# EAGLE design ground_station_power_board (EAGLE 9.1.1)
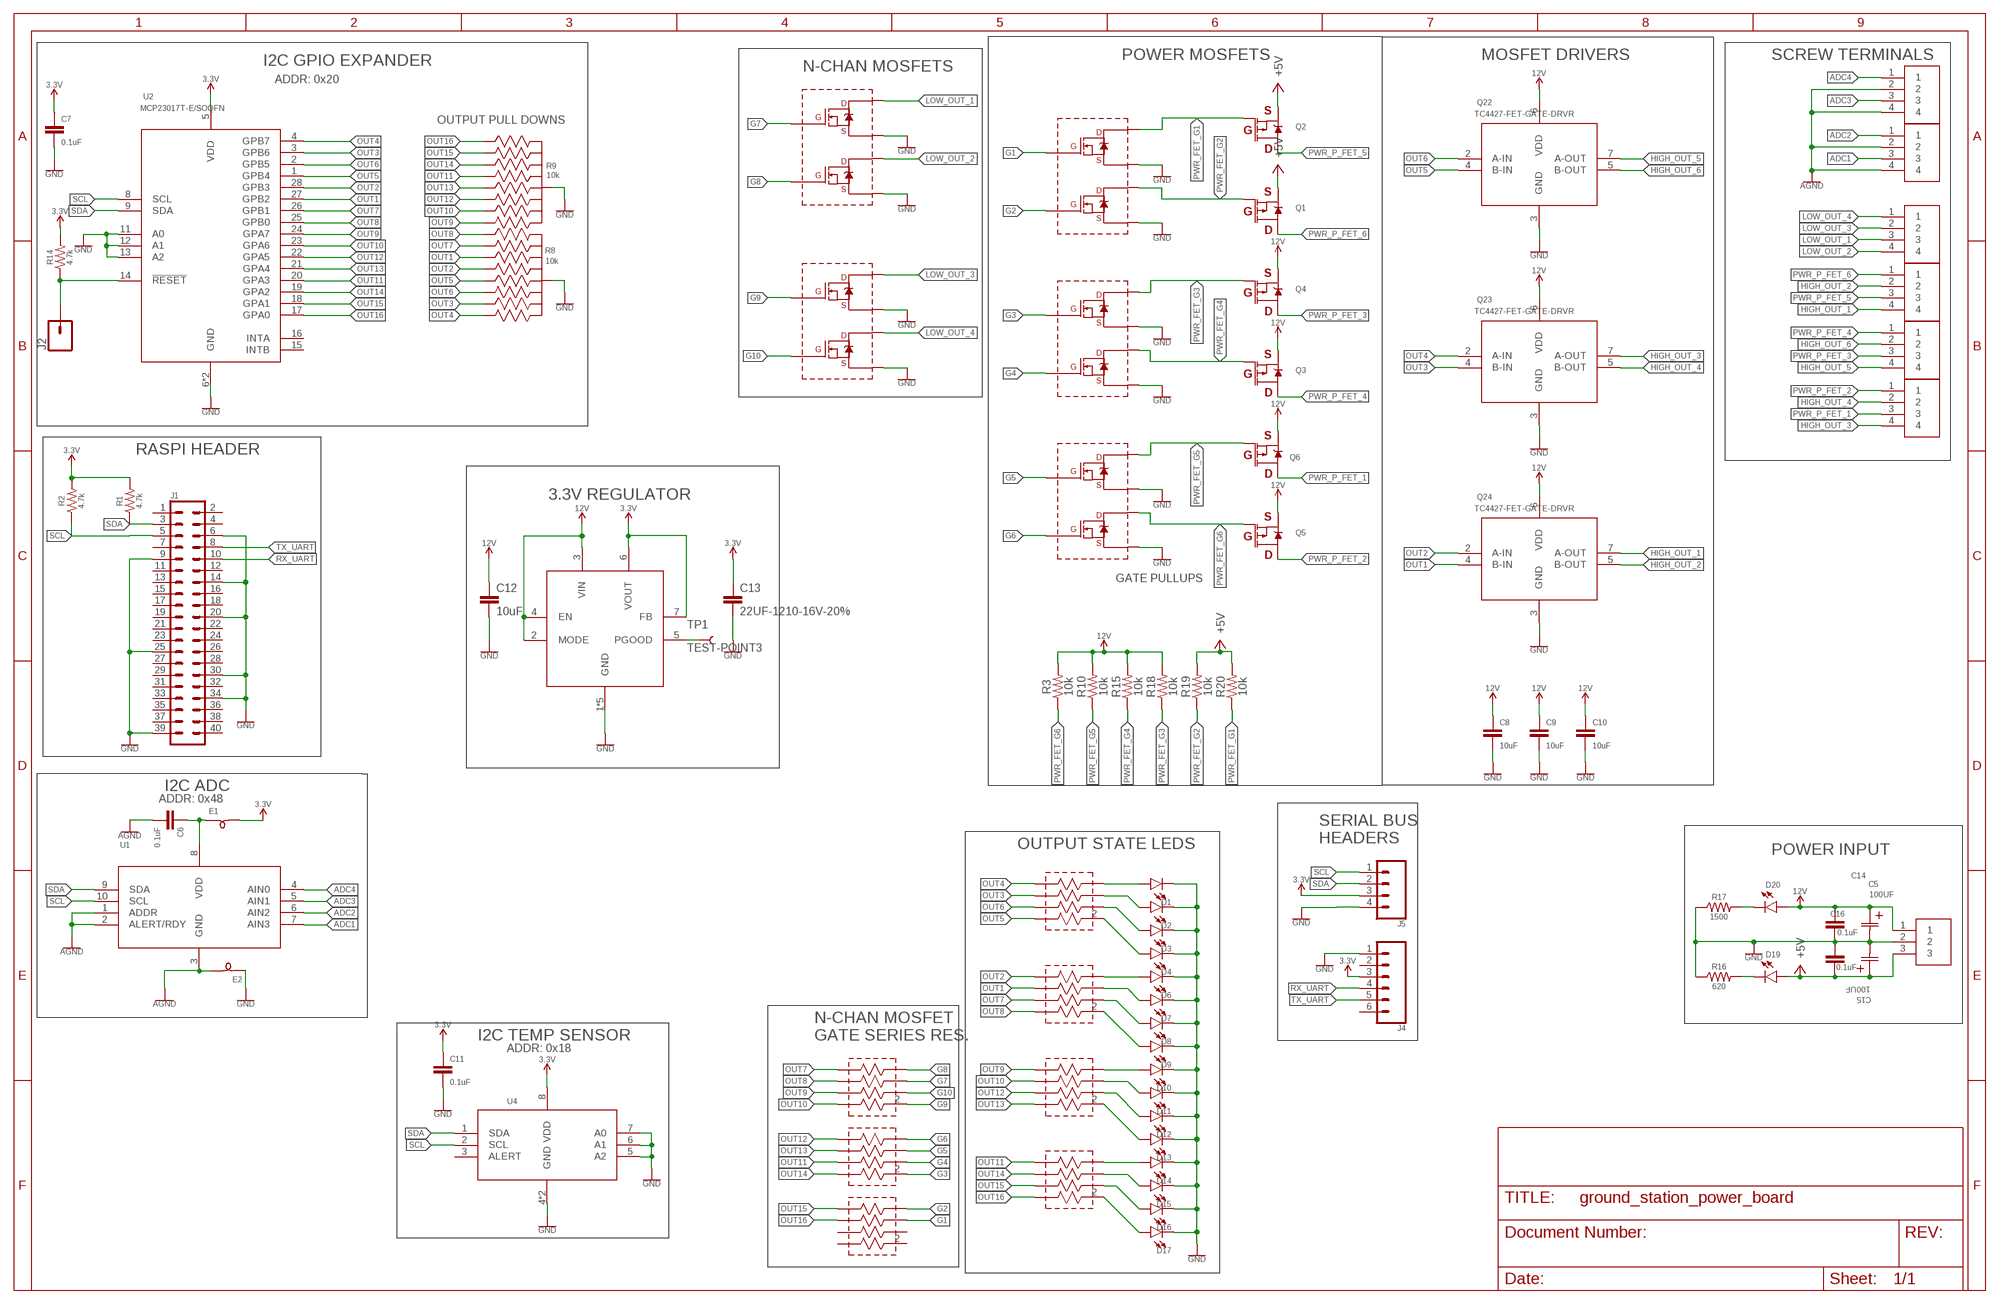
[diagram p0: schematic, sheet 1]

## Parts
C5  100UF  100UF-CAP-EMVH630ARA101MKE0SCHEMI-KE0-M  [CHEMI-KE0-M]
C6  0.1uF  0.1UF-0603-25V-5%  [0603]
C7  0.1uF  0.1UF-0603-25V-5%  [0603]
C8  10uF  10UF-0805-10V-10%  [0805]
C9  10uF  10UF-0805-10V-10%  [0805]
C10  10uF  10UF-0805-10V-10%  [0805]
C11  0.1uF  0.1UF-0603-25V-5%  [0603]
C12  10uF  10UF-1206-6.3V-20%  [1206]
C13  22UF-1210-16V-20%  [1210]
C14  0.1uF  0.1UF-0603-25V-5%  [0603]
C15  100UF  100UF-CAP-EMVH630ARA101MKE0SCHEMI-KE0-M  [CHEMI-KE0-M]
C16  0.1uF  0.1UF-0603-25V-5%  [0603]
D1  LED0603  [LED-0603]
D2  LED0603  [LED-0603]
D3  LED0603  [LED-0603]
D4  LED0603  [LED-0603]
D6  LED0603  [LED-0603]
D7  LED0603  [LED-0603]
D8  LED0603  [LED-0603]
D9  LED0603  [LED-0603]
D10  LED0603  [LED-0603]
D11  LED0603  [LED-0603]
D12  LED0603  [LED-0603]
D13  LED0603  [LED-0603]
D14  LED0603  [LED-0603]
D15  LED0603  [LED-0603]
D16  LED0603  [LED-0603]
D17  LED0603  [LED-0603]
D19  LED0603  [LED-0603]
D20  LED0603  [LED-0603]
E1  L-BEAD-0805-B  [.0805-B]
E2  L-BEAD-0805-B  [.0805-B]
J1  CONN_20X2SHROUDED  [2X20_SHROUDED]
J2  CONN_01PTH_NO_SILK_KIT  [1X01NS_KIT]
J4  CONN_06LONGPADS  [1X06_LONGPADS]
J5  CONN_04LONGPADS  [1X04_LONGPADS]
Q1  SQJ459EP_MOSFET_P_CHAN  [POWERPAK_S0-8L]
Q2  SQJ459EP_MOSFET_P_CHAN  [POWERPAK_S0-8L]
Q3  SQJ459EP_MOSFET_P_CHAN  [POWERPAK_S0-8L]
Q4  SQJ459EP_MOSFET_P_CHAN  [POWERPAK_S0-8L]
Q5  SQJ459EP_MOSFET_P_CHAN  [POWERPAK_S0-8L]
Q6  SQJ459EP_MOSFET_P_CHAN  [POWERPAK_S0-8L]
Q8  DMN61D8LVT-DUAL-N-CHANNEL-MOSFET  [TSOT26]
Q9  DMN61D8LVT-DUAL-N-CHANNEL-MOSFET  [TSOT26]
Q15  DMN61D8LVT-DUAL-N-CHANNEL-MOSFET  [TSOT26]
Q17  DMN61D8LVT-DUAL-N-CHANNEL-MOSFET  [TSOT26]
Q18  DMN61D8LVT-DUAL-N-CHANNEL-MOSFET  [TSOT26]
Q22  TC4427-FET-GATE-DRVR  [TSSOP-8]
Q23  TC4427-FET-GATE-DRVR  [TSSOP-8]
Q24  TC4427-FET-GATE-DRVR  [TSSOP-8]
R1  4.7k  4.7KOHM-0603-1/10W-1%  [0603]
R2  4.7k  4.7KOHM-0603-1/10W-1%  [0603]
R3  10k  10KOHM-0603-1/10W-1%  [0603]
R4  680  RES-ARRAY-742C083  [RES-ARRAY-742C083]
R5  680  RES-ARRAY-742C083  [RES-ARRAY-742C083]
R6  680  RES-ARRAY-742C083  [RES-ARRAY-742C083]
R7  680  RES-ARRAY-742C083  [RES-ARRAY-742C083]
R8  10k  EXB-A10P391JC_ARRAY_EXBA-M  [C_ARRAY_EXBA-M]
R9  10k  EXB-A10P391JC_ARRAY_EXBA-M  [C_ARRAY_EXBA-M]
R10  10k  10KOHM-0603-1/10W-1%  [0603]
R11  220  RES-ARRAY-742C083  [RES-ARRAY-742C083]
R12  220  RES-ARRAY-742C083  [RES-ARRAY-742C083]
R13  220  RES-ARRAY-742C083  [RES-ARRAY-742C083]
R14  4.7k  4.7KOHM-0603-1/10W-1%  [0603]
R15  10k  10KOHM-0603-1/10W-1%  [0603]
R16  620  4.7KOHM-0603-1/10W-1%  [0603]
R17  1500  4.7KOHM-0603-1/10W-1%  [0603]
R18  10k  10KOHM-0603-1/10W-1%  [0603]
R19  10k  10KOHM-0603-1/10W-1%  [0603]
R20  10k  10KOHM-0603-1/10W-1%  [0603]
TP1  TEST-POINT3  [PAD.03X.03]
U1  ADS1115IDGSTDGS10-M  [DGS10-M]
U2  MCP23017T-E/SOQFN  [QFN28_6X6MC-M]
U4  MCP9808T-E/MCDFN8_2X3MC-M  [DFN8_2X3MC-M]
U$1  1719031-PHONEIX-CONTACT-DBL-TERMINAL-BLOCK  [1719031-PHONEIX-CONTACT-DBL-TERMINAL-BLOCK]
U$2  1719031-PHONEIX-CONTACT-DBL-TERMINAL-BLOCK  [1719031-PHONEIX-CONTACT-DBL-TERMINAL-BLOCK]
U$3  1719031-PHONEIX-CONTACT-DBL-TERMINAL-BLOCK  [1719031-PHONEIX-CONTACT-DBL-TERMINAL-BLOCK]
U$4  1719031-PHONEIX-CONTACT-DBL-TERMINAL-BLOCK  [1719031-PHONEIX-CONTACT-DBL-TERMINAL-BLOCK]
U$5  1719031-PHONEIX-CONTACT-DBL-TERMINAL-BLOCK  [1719031-PHONEIX-CONTACT-DBL-TERMINAL-BLOCK]
U$6  1719031-PHONEIX-CONTACT-DBL-TERMINAL-BLOCK  [1719031-PHONEIX-CONTACT-DBL-TERMINAL-BLOCK]
U$9  LMZM23601V3SILT  [MICRO-SIP]
U$11  1714968-PHONEIX-CONTACT-TERMINAL-BLOCK  [1714968-PHONEIX-CONTACT-3-TERMINAL-BLOCK]

## Nets
3.3V: C7.1 C11.1 C13.1 E1.2 J4.3 J5.3 R1.2 R2.2 R14.2 U2.5(VDD) U4.8(VDD) U$9.6(VOUT) U$9.7(FB)
12V: C5.1 C8.1 C9.1 C10.1 C12.1 C14.1 D20.A Q3.S1(S) Q3.S2(S) Q3.S3(S) Q4.S1(S) Q4.S2(S) Q4.S3(S) Q5.S1(S) Q5.S2(S) Q5.S3(S) Q6.S1(S) Q6.S2(S) Q6.S3(S) Q22.6(VDD) Q23.6(VDD) Q24.6(VDD) R3.2 R10.2 R15.2 R18.2 U$9.2(MODE) U$9.3(VIN) U$9.4(EN) U$11.1
+5V: C15.1 C16.2 D19.A Q1.S1(S) Q1.S2(S) Q1.S3(S) Q2.S1(S) Q2.S2(S) Q2.S3(S) R19.2 R20.2 U$11.3
ADC1: U1.7(AIN3) U$5.3
ADC2: U1.6(AIN2) U$5.1
ADC3: U1.5(AIN1) U$6.3
ADC4: U1.4(AIN0) U$6.1
AGND: C6.2 E2.2 U1.1(ADDR) U1.2(ALERT/RDY) U1.3(GND) U$5.2 U$5.4 U$6.2 U$6.4
G1: Q8.5(G2) R11.6(!1OE6)
G2: Q8.2(G1) R11.8(!1OE8)
G3: Q9.5(G2) R12.2(!1OE2)
G4: Q9.2(G1) R12.4(!1OE4)
G5: Q15.5(G2) R12.6(!1OE6)
G6: Q15.2(G1) R12.8(!1OE8)
G7: Q18.5(G2) R13.6(!1OE6)
G8: Q18.2(G1) R13.8(!1OE8)
G9: Q17.5(G2) R13.2(!1OE2)
G10: Q17.2(G1) R13.4(!1OE4)
GND: C5.2 C7.2 C8.2 C9.2 C10.2 C11.2 C12.2 C13.2 C14.2 C15.2 C16.1 D1.C D2.C D3.C D4.C D6.C D7.C D8.C D9.C D10.C D11.C D12.C D13.C D14.C D15.C D16.C D17.C E2.1 J1.6 J1.9 J1.14 J1.20 J1.25 J1.30 J1.34 J1.39 J4.1 J5.4 Q8.1(S1) Q8.4(S2) Q9.1(S1) Q9.4(S2) Q15.1(S1) Q15.4(S2) Q17.1(S1) Q17.4(S2) Q18.1(S1) Q18.4(S2) Q22.3(GND) Q23.3(GND) Q24.3(GND) R8.5 R8.10 R9.5 R9.10 R16.1 R17.1 U2.6(GND) U2.11(A0) U2.12(A1) U2.13(A2) U2.29(GND) U4.4(GND) U4.5(A2) U4.6(A1) U4.7(A0) U4.9(GND) U$9.1(GND) U$9.TP(GND) U$9.V1(GND) U$9.V2(GND) U$9.V3(GND) U$11.2
HIGH_OUT_1: Q24.7(A-OUT) U$3.4
HIGH_OUT_2: Q24.5(B-OUT) U$3.2
HIGH_OUT_3: Q23.7(A-OUT) U$1.4
HIGH_OUT_4: Q23.5(B-OUT) U$1.2
HIGH_OUT_5: Q22.7(A-OUT) U$2.4
HIGH_OUT_6: Q22.5(B-OUT) U$2.2
LOW_OUT_1: Q18.3(D2) U$4.3
LOW_OUT_2: Q18.6(D1) U$4.4
LOW_OUT_3: Q17.3(D2) U$4.2
LOW_OUT_4: Q17.6(D1) U$4.1
N$1: D1.A R4.8(!1OE8)
N$2: D2.A R4.6(!1OE6)
N$3: D3.A R4.4(!1OE4)
N$4: D4.A R4.2(!1OE2)
N$5: C6.1 E1.1 U1.8(VDD)
N$6: J2.1 R14.1 U2.14(!RESET)
N$7: TP1.P$1 U$9.5(PGOOD)
N$12: D19.C R16.2
N$14: D6.A R5.8(!1OE8)
N$15: D7.A R5.6(!1OE6)
N$16: D8.A R5.4(!1OE4)
N$17: D9.A R5.2(!1OE2)
N$18: D20.C R17.2
N$26: D10.A R6.8(!1OE8)
N$27: D11.A R6.6(!1OE6)
N$28: D12.A R6.4(!1OE4)
N$29: D13.A R6.2(!1OE2)
N$38: D14.A R7.8(!1OE8)
N$39: D15.A R7.6(!1OE6)
N$40: D16.A R7.4(!1OE4)
N$41: D17.A R7.2(!1OE2)
OUT1: Q24.4(B-IN) R5.5(!1OE5) R8.2 U2.27(GPB2)
OUT2: Q24.2(A-IN) R5.7(!1OE7) R8.8 U2.28(GPB3)
OUT3: Q23.4(B-IN) R4.5(!1OE5) R8.4 U2.3(GPB6)
OUT4: Q23.2(A-IN) R4.7(!1OE7) R8.6 U2.4(GPB7)
OUT5: Q22.4(B-IN) R4.1(!1OE1) R8.3 U2.1(GPB4)
OUT6: Q22.2(A-IN) R4.3(!1OE3) R8.7 U2.2(GPB5)
OUT7: R5.3(!1OE3) R8.9 R13.7(!1OE7) U2.26(GPB1)
OUT8: R5.1(!1OE1) R8.1 R13.5(!1OE5) U2.25(GPB0)
OUT9: R6.7(!1OE7) R9.6 R13.3(!1OE3) U2.24(GPA7)
OUT10: R6.5(!1OE5) R9.4 R13.1(!1OE1) U2.23(GPA6)
OUT11: R7.7(!1OE7) R9.8 R12.3(!1OE3) U2.20(GPA3)
OUT12: R6.3(!1OE3) R9.7 R12.7(!1OE7) U2.22(GPA5)
OUT13: R6.1(!1OE1) R9.3 R12.5(!1OE5) U2.21(GPA4)
OUT14: R7.5(!1OE5) R9.2 R12.1(!1OE1) U2.19(GPA2)
OUT15: R7.3(!1OE3) R9.9 R11.7(!1OE7) U2.18(GPA1)
OUT16: R7.1(!1OE1) R9.1 R11.5(!1OE5) U2.17(GPA0)
PWR_FET_G1: Q2.G Q8.3(D2) R20.1
PWR_FET_G2: Q1.G Q8.6(D1) R19.1
PWR_FET_G3: Q4.G Q9.3(D2) R18.1
PWR_FET_G4: Q3.G Q9.6(D1) R15.1
PWR_FET_G5: Q6.G Q15.3(D2) R10.1
PWR_FET_G6: Q5.G Q15.6(D1) R3.1
PWR_P_FET_1: Q6.D1(D) U$1.3
PWR_P_FET_2: Q5.D1(D) U$1.1
PWR_P_FET_3: Q4.D1(D) U$2.3
PWR_P_FET_4: Q3.D1(D) U$2.1
PWR_P_FET_5: Q2.D1(D) U$3.3
PWR_P_FET_6: Q1.D1(D) U$3.1
RX_UART: J1.10 J4.4
SCL: J1.5 J5.1 R2.1 U1.10(SCL) U2.8(SCL) U4.2(SCL)
SDA: J1.3 J5.2 R1.1 U1.9(SDA) U2.9(SDA) U4.1(SDA)
TX_UART: J1.8 J4.5
Unconnected: J1.1 J1.2 J1.4 J1.7 J1.11 J1.12 J1.13 J1.15 J1.16 J1.17 J1.18 J1.19 J1.21 J1.22 J1.23 J1.24 J1.26 J1.27 J1.28 J1.29 J1.31 J1.32 J1.33 J1.35 J1.36 J1.37 J1.38 J1.40 J4.2 J4.6 R11.1(!1OE1) R11.2(!1OE2) R11.3(!1OE3) R11.4(!1OE4) U2.15(INTB) U2.16(INTA) U4.3(ALERT)

## Notes on the sheet
- POWER MOSFETS | MOSFET DRIVERS | SCREW TERMINALS
- I2C GPIO EXPANDER
- N-CHAN MOSFETS
- ADDR: 0x20
- OUTPUT PULL DOWNS
- RASPI HEADER
- 3.3V REGULATOR
- GATE PULLUPS
- I2C ADC
- ADDR: 0x48
- SERIAL BUS
  HEADERS
- OUTPUT STATE LEDS
- POWER INPUT
- I2C TEMP SENSOR
- N-CHAN MOSFET
  GATE SERIES RES.
- ADDR: 0x18

## Library data of the parts
C5 C15 = GROUND-STATION-POWER-BOARD:100UF-CAP-EMVH630ARA101MKE0S; MANUFACTURER_PART_NUMBER: EMVH630ARA101MKE0S; VENDOR: Nippon ChemiCon
C6 C7 C11 C14 C16 = SparkFun-Capacitors:0.1UF: 0.1µF ceramic capacitors A capacitor is a passive two-terminal electrical component used to store electrical energy temporarily in an electric field.; PROD_ID: CAP-08604
C8-C10 = SparkFun-Capacitors:10UF: 10.0µF ceramic capacitors A capacitor is a passive two-terminal electrical component used to store electrical energy temporarily in an electric field.; PROD_ID: CAP-11330
C12 = SparkFun-Capacitors:10UF: 10.0µF ceramic capacitors A capacitor is a passive two-terminal electrical component used to store electrical energy temporarily in an electric field.; PROD_ID: CAP-10057
C13 = SparkFun-Capacitors:22UF: 22µF ceramic capacitors A capacitor is a passive two-terminal electrical component used to store electrical energy temporarily in an electric field.
D1-D4 D6-D17 D19 D20 = SparkFun-LED:LED: LED (Generic) Standard schematic elements and footprints for 5mm, 3mm, 1206, and 0603 sized LEDs. Generic LEDs with no color specified.
E1 E2 = oresat-rcl:L-BEAD-*: Bead or Chip inductor ("ferrite bead") for EMI suppression
J1 = SparkFun-Connectors:CONN_20X2: Multi connection point. Often used as Generic Header-pin footprint for 0.1 inch spaced/style header connections On any of the 0.1 inch spaced packages, you can populate with these: Break Away Headers - Straight <https://www.sparkfun.com/products/116> (PRT-00116) Break Away Male Headers - Right Angle <https://www.sparkfun.com/products/553> (PRT-00553) Female Headers <https://www.sparkfun.com/products/115> (PRT-00115) Break Away Headers - Machine Pin <https://www.sparkfun.com/products/117> (PRT-00117) Break Away Female Headers - Swiss Machine Pin <https://www.sparkfun.com/products/743> (PRT-00743); PROD_ID: CONN-12263; SF_ID: CONN-12263
J2 = SparkFun-Connectors:CONN_01: Single connection point. Often used as Generic Header-pin footprint for 0.1 inch spaced/style header connections On any of the 0.1 inch spaced packages, you can populate with these: Break Away Headers - Straight <https://www.sparkfun.com/products/116> (PRT-00116) Break Away Male Headers - Right Angle <https://www.sparkfun.com/products/553> (PRT-00553) Female Headers <https://www.sparkfun.com/products/115> (PRT-00115) Break Away Headers - Machine Pin <https://www.sparkfun.com/products/117> (PRT-00117) Break Away Female Headers - Swiss Machine Pin <https://www.sparkfun.com/products/743> (PRT-00743) This device is also useful as a general connection point to wire up your design to another part of your project. Our various solder wires solder well into these plated through hole pads. Hook-Up Wire - Assortment (Stranded, 22 AWG) <https://www.sparkfun.com/products/11375> (PRT-11375) Hook-Up Wire - Assortment (Solid Core, 22 AWG) <https://www.sparkfun.com/products/11367> (PRT-11367) View the entire wire category on our website here <https://www.sparkfun.com/categories/141> Special notes: SMTSO-256-ET is a "flush mount" nut for a 4-40 screw. We mostly use this on specialty testbeds; it is a nice way to connect hardware to your PCB at an adjustable hieght. Also note, the SNAP packages are for using a snappable style connector. We sell a baggie of snaps and they are also used on two LilyPad designs: Snap Assortment - 30 pack (male and female) <https://www.sparkfun.com/products/11347> (DEV-11347) LilyPad Arduino SimpleSnap <https://www.sparkfun.com/products/10941> (DEV-10941) LilyPad SimpleSnap Protoboard <https://www.sparkfun.com/products/10940> (DEV-10940)
J4 = SparkFun-Connectors:CONN_06: Multi connection point. Often used as Generic Header-pin footprint for 0.1 inch spaced/style header connections On any of the 0.1 inch spaced packages, you can populate with these: Break Away Headers - Straight <https://www.sparkfun.com/products/116> (PRT-00116) Break Away Male Headers - Right Angle <https://www.sparkfun.com/products/553> (PRT-00553) Female Headers <https://www.sparkfun.com/products/115> (PRT-00115) Break Away Headers - Machine Pin <https://www.sparkfun.com/products/117> (PRT-00117) Break Away Female Headers - Swiss Machine Pin <https://www.sparkfun.com/products/743> (PRT-00743) Arduino Stackable Header - 6 Pin <https://www.sparkfun.com/products/9280> (PRT-09280) For SCREWTERMINALS and SPRING TERMINALS visit here: Screw Terimnals on SparkFun.com <https://www.sparkfun.com/search/results?term=Screw+Terminals> (5mm/3.5mm/2.54mm spacing) This device is also useful as a general connection point to wire up your design to another part of your project. Our various solder wires solder well into these plated through hole pads. Hook-Up Wire - Assortment (Stranded, 22 AWG) <https://www.sparkfun.com/products/11375> (PRT-11375) Hook-Up Wire - Assortment (Solid Core, 22 AWG) <https://www.sparkfun.com/products/11367> (PRT-11367) View the entire wire category on our website here <https://www.sparkfun.com/categories/141>
J5 = SparkFun-Connectors:CONN_04: Multi connection point. Often used as Generic Header-pin footprint for 0.1 inch spaced/style header connections On any of the 0.1 inch spaced packages, you can populate with these: Break Away Headers - Straight <https://www.sparkfun.com/products/116> (PRT-00116) Break Away Male Headers - Right Angle <https://www.sparkfun.com/products/553> (PRT-00553) Female Headers <https://www.sparkfun.com/products/115> (PRT-00115) Break Away Headers - Machine Pin <https://www.sparkfun.com/products/117> (PRT-00117) Break Away Female Headers - Swiss Machine Pin <https://www.sparkfun.com/products/743> (PRT-00743) For SCREWTERMINALS and SPRING TERMINALS visit here: Screw Terimnals on SparkFun.com <https://www.sparkfun.com/search/results?term=Screw+Terminals> (5mm/3.5mm/2.54mm spacing) This device is also useful as a general connection point to wire up your design to another part of your project. Our various solder wires solder well into these plated through hole pads. Hook-Up Wire - Assortment (Stranded, 22 AWG) <https://www.sparkfun.com/products/11375> (PRT-11375) Hook-Up Wire - Assortment (Solid Core, 22 AWG) <https://www.sparkfun.com/products/11367> (PRT-11367) View the entire wire category on our website here <https://www.sparkfun.com/categories/141> Special notes: Molex polarized connector foot print use with SKU : PRT-08231 with associated crimp pins and housings. 1MM SMD Version SKU: PRT-10208; PROD_ID: CONN-09696
Q1-Q6 = GROUND-STATION-POWER-BOARD:SQJ459EP_MOSFET_P_CHAN
Q8 Q9 Q15 Q17 Q18 = GROUND-STATION-POWER-BOARD:DMN61D8LVT-DUAL-N-CHANNEL-MOSFET
Q22-Q24 = GROUND-STATION-POWER-BOARD:TC4427-FET-GATE-DRVR
R1 R2 R14 = SparkFun-Resistors:4.7KOHM: 4.7kΩ resistor A resistor is a passive two-terminal electrical component that implements electrical resistance as a circuit element. Resistors act to reduce current flow, and, at the same time, act to lower voltage levels within circuits. - Wikipedia; PROD_ID: RES-07857
R3 R10 R15 R18-R20 = SparkFun-Resistors:10KOHM: 10kΩ resistor A resistor is a passive two-terminal electrical component that implements electrical resistance as a circuit element. Resistors act to reduce current flow, and, at the same time, act to lower voltage levels within circuits. - Wikipedia; PROD_ID: RES-00824
R4-R7 R11-R13 = GROUND-STATION-POWER-BOARD:RES-ARRAY-742C083
R8 R9 = temp-lib:EXB-A10P391J; MANUFACTURER_PART_NUMBER: EXBA10P391J; VENDOR: Panasonic
R16 R17 = SparkFun-Resistors:4.7KOHM: 4.7kΩ resistor A resistor is a passive two-terminal electrical component that implements electrical resistance as a circuit element. Resistors act to reduce current flow, and, at the same time, act to lower voltage levels within circuits. - Wikipedia; PROD_ID: RES-07857; VALUE: 4.7k
TP1 = SparkFun-Connectors:TEST-POINT: SparkFun Test Points Bare copper test points for troubleshooting or In-Circuit-Testing. These are used by our Production team for verifying production board runs using pogo-pins on test beds. SparkFun Products: SparkFun LSM9DS1 Breakout <https://www.sparkfun.com/products/13284> SparkFun PSOC <https://www.sparkfun.com/products/13714> SparkFun Load Cell Amplifier <https://www.sparkfun.com/products/13879>
U1 = GROUND-STATION-POWER-BOARD:ADS1115IDGST; MANUFACTURER_PART_NUMBER: ADS1115IDGST; VENDOR: Texas Instruments
U2 = GROUND-STATION-POWER-BOARD:MCP23017T-E/SO
U4 = GROUND-STATION-POWER-BOARD:MCP9808T-E/MC; MANUFACTURER_PART_NUMBER: MCP9808TEMC; VENDOR: Microchip
U$1-U$6 = GROUND-STATION-POWER-BOARD:1719031-PHONEIX-CONTACT-DBL-TERMINAL-BLOCK
U$9 = GROUND-STATION-POWER-BOARD:LMZM23601V3SILT
U$11 = GROUND-STATION-POWER-BOARD:1714968-PHONEIX-CONTACT-TERMINAL-BLOCK

## Board
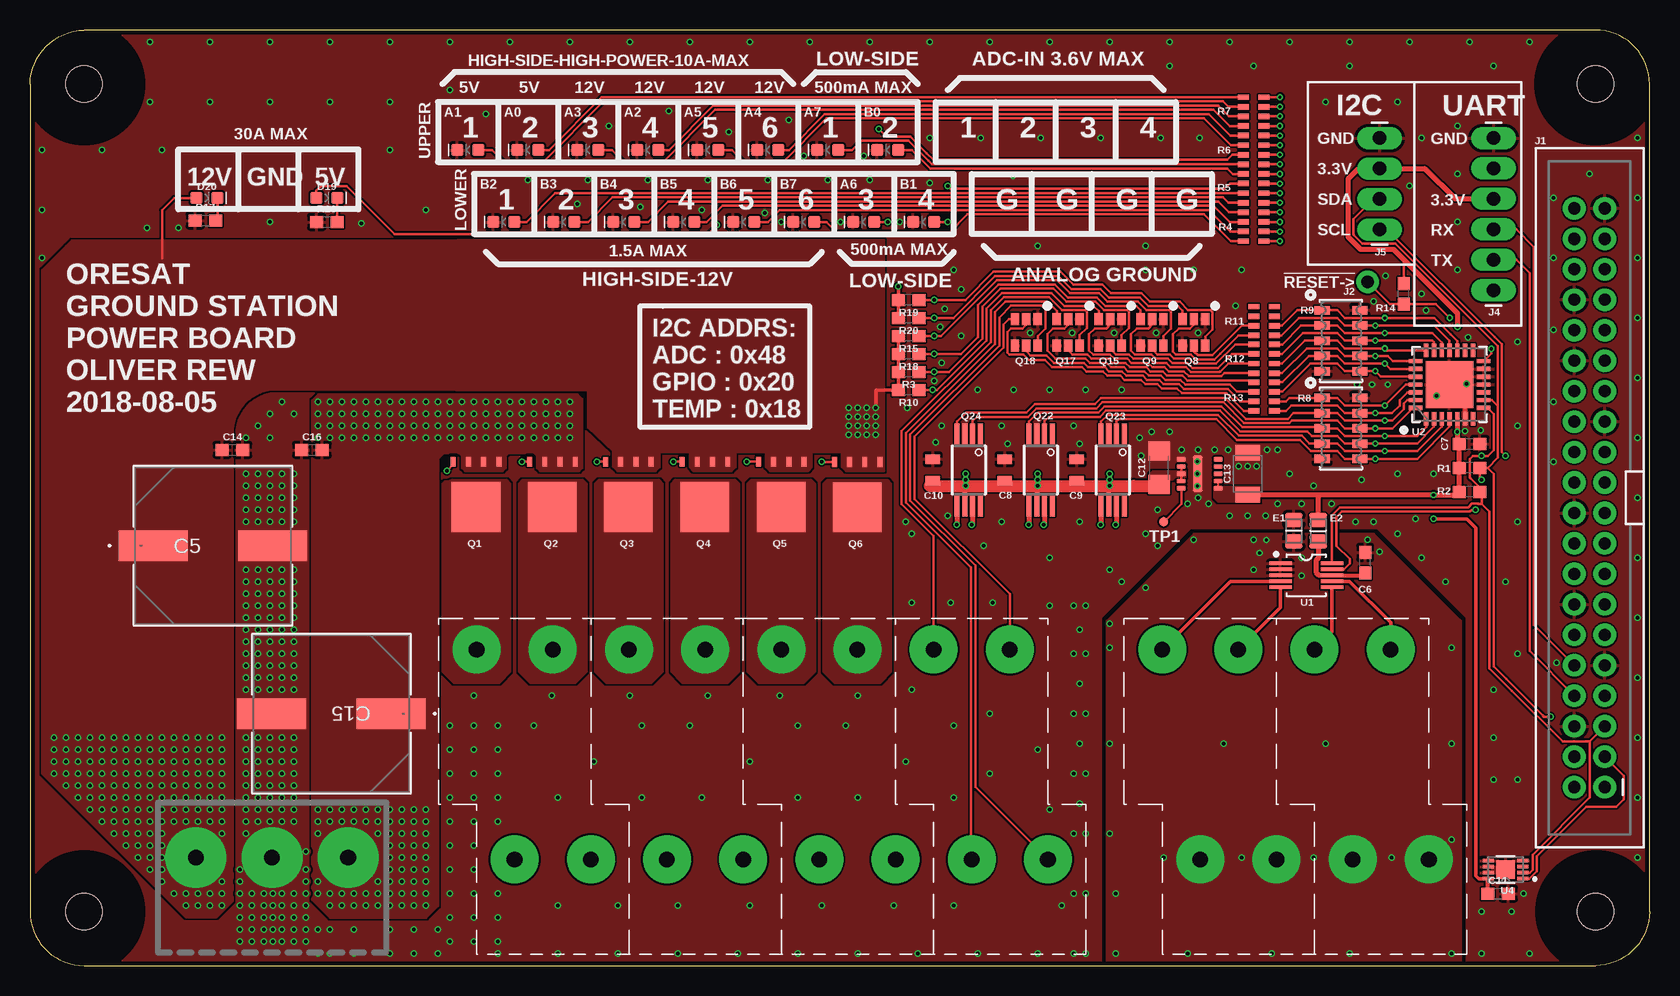
[diagram p1: board, top side]
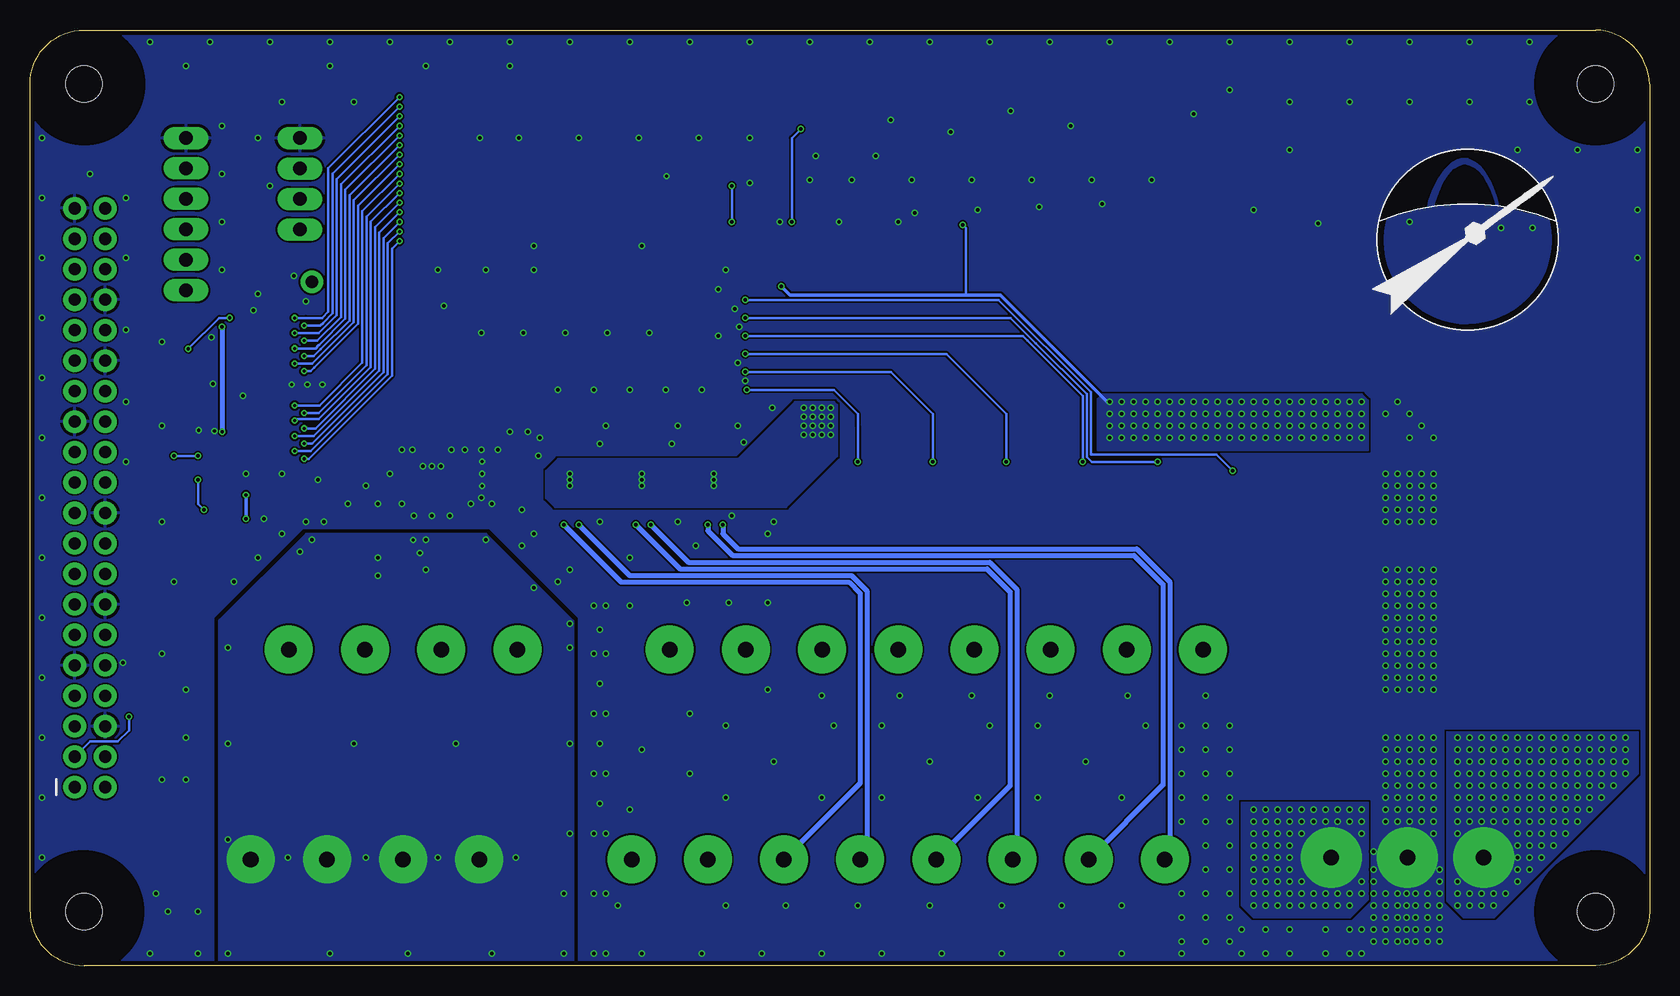
[diagram p2: board, bottom side, seen from below]

Size 135 x 78 mm. Coordinates in mm from the lower left corner, seen from the top.
Outline: 130.5,78 4.5,78 arc87 0,73.5 0,4.5 arc90 4.5,0 130.5,0 arc90 135,4.5 135,73.5 arc90 130.5,78
Copper layers (1*16): Top 0.035559375mm / dielectric 1.6mm / Bottom 0.035559375mm
Design rules "oshpark-2layer-tented": minimum track width 6mil, minimum drill 10mil, track to track 6mil, track to pad 6mil, pad to pad 6mil, via to via 6mil, smd to smd 6mil, copper to edge 15mil, drill to drill 6mil, minimum pad ring 5mil, minimum via ring 5mil, stop-mask expansion 2.5mil, vias tented up to drill 100mil, thermal gap 10mil
Holes 3 mm at 130.5,73.5 4.5,73.5 4.5,4.5 130.5,4.5
tRestrict: area -0.5,-0.5 to 9.5,9.5; area -0.5,68.5 to 9.5,78.5; area 125.5,68.5 to 135.5,78.5; area 125.6,-0.5 to 135.6,9.5
bRestrict: area -0.5,-0.5 to 9.5,9.5; area -0.5,68.5 to 9.5,78.5; area 125.5,68.5 to 135.5,78.5; area 125.6,-0.5 to 135.6,9.5; area 125.6,-0.5 to 135.6,9.5

### Footprints (pad centres in the part's own frame; a part is rotated, then mirrored left to right if it is on the bottom)
CHEMI-KE0-M = smd 5.74 x 2.515: 1 -4.966,0; 2 4.966,0
0603 = smd 1.1 x 1: 1 -0.85,0; 2 0.85,0
0805 = smd 0.8 x 1.2: 1 -0.9,0; 2 0.9,0
1206 = smd 1.6 x 1.8: 1 -1.4,0; 2 1.4,0
1210 = smd 1.27 x 2.06: 1 -1.755,0; 2 1.755,0
LED-0603 = smd 1 x 1: A -0.877,0; C 0.877,0
.0805-B = smd 1.15 x 1.45: 1 -0.9,0; 2 0.9,0
2X20_SHROUDED = drill 1.016 pad 1.88: 1 -1.27,24.13; 2 1.27,24.13; 3 -1.27,21.59; 4 1.27,21.59; 5 -1.27,19.05; 6 1.27,19.05; 7 -1.27,16.51; 8 1.27,16.51; 9 -1.27,13.97; 10 1.27,13.97; 11 -1.27,11.43; 12 1.27,11.43; 13 -1.27,8.89; 14 1.27,8.89; 15 -1.27,6.35; 16 1.27,6.35; 17 -1.27,3.81; 18 1.27,3.81; 19 -1.27,1.27; 20 1.27,1.27; 21 -1.27,-1.27; 22 1.27,-1.27; 23 -1.27,-3.81; 24 1.27,-3.81; 25 -1.27,-6.35; 26 1.27,-6.35; 27 -1.27,-8.89; 28 1.27,-8.89; 29 -1.27,-11.43; 30 1.27,-11.43; 31 -1.27,-13.97; 32 1.27,-13.97; 33 -1.27,-16.51; 34 1.27,-16.51; 35 -1.27,-19.05; 36 1.27,-19.05; 37 -1.27,-21.59; 38 1.27,-21.59; 39 -1.27,-24.13; 40 1.27,-24.13
1X01NS_KIT = drill 1.016 pad 1.88: 1 0,0
1X06_LONGPADS = drill 1.118 pad 1.88 long: 1 0,0; 2 2.54,0; 3 5.08,0; 4 7.62,0; 5 10.16,0; 6 12.7,0
1X04_LONGPADS = drill 1.118 pad 1.88 long: 1 0,0; 2 2.54,0; 3 5.08,0; 4 7.62,0
POWERPAK_S0-8L = smd 4.061 x 4.14: D1 0,1.055 | smd 0.41 x 0.82: G 1.905,-2.715; S1 -1.905,-2.715; S2 -0.635,-2.715; S3 0.635,-2.715
TSOT26 = smd 0.7 x 1: 1 -0.95,-1.099; 2 0,-1.099; 3 0.95,-1.099; 4 0.95,1.099; 5 0,1.099; 6 -0.95,1.099
TSSOP-8 = smd 0.42 x 1.78: 1 -0.975,-2.975; 2 -0.325,-2.975; 3 0.325,-2.975; 4 0.975,-2.975; 5 0.975,2.975; 6 0.325,2.975; 7 -0.325,2.975; 8 -0.975,2.975
RES-ARRAY-742C083 = smd 0.45 x 0.9: 1 -1.2,0.85; 2 -1.2,-0.85; 3 -0.4,0.85; 4 -0.4,-0.85; 5 0.4,0.85; 6 0.4,-0.85; 7 1.2,0.85; 8 1.2,-0.85
C_ARRAY_EXBA-M = smd 1.27 x 0.711: 1 -1.575,2.54; 2 -1.575,1.27; 3 -1.575,0; 4 -1.575,-1.27; 5 -1.575,-2.54; 6 1.575,-2.54; 7 1.575,-1.27; 8 1.575,0; 9 1.575,1.27; 10 1.575,2.54
PAD.03X.03 = smd 0.762 x 0.762: P$1 0,0
DGS10-M = smd 1.88 x 0.279: 1 -2.146,1; 2 -2.146,0.5; 3 -2.146,0; 4 -2.146,-0.5; 5 -2.146,-1; 6 2.146,-1; 7 2.146,-0.5; 8 2.146,0; 9 2.146,0.5; 10 2.146,1
QFN28_6X6MC-M = smd 1.118 x 0.356: 1 -2.845,1.95; 2 -2.845,1.3; 3 -2.845,0.65; 4 -2.845,0; 5 -2.845,-0.65; 6 -2.845,-1.3; 7 -2.845,-1.95; 15 2.845,-1.95; 16 2.845,-1.3; 17 2.845,-0.65; 18 2.845,0; 19 2.845,0.65; 20 2.845,1.3; 21 2.845,1.95 | smd 0.356 x 1.118: 8 -1.95,-2.845; 9 -1.3,-2.845; 10 -0.65,-2.845; 11 0,-2.845; 12 0.65,-2.845; 13 1.3,-2.845; 14 1.95,-2.845; 22 1.95,2.845; 23 1.3,2.845; 24 0.65,2.845; 25 0,2.845; 26 -0.65,2.845; 27 -1.3,2.845; 28 -1.95,2.845 | smd 3.937 x 3.937: 29 0,0
DFN8_2X3MC-M = smd 0.914 x 0.305: 1 -1.448,0.75; 2 -1.448,0.25; 3 -1.448,-0.25; 4 -1.448,-0.75; 5 1.448,-0.75; 6 1.448,-0.25; 7 1.448,0.25; 8 1.448,0.75 | smd 1.575 x 1.524: 9 0,0
1719031-PHONEIX-CONTACT-DBL-TERMINAL-BLOCK = drill 1.3 pad 4: 1 0,0; 2 3.175,-17.5; 3 6.35,0; 4 9.525,-17.5
MICRO-SIP = smd 0.75 x 0.4: 1 -1.525,1.2; 2 -1.525,0.6; 3 -1.525,0; 4 -1.525,-0.6; 5 -1.525,-1.2; 6 1.525,-1.2; 7 1.525,-0.6; 8 1.525,0; 9 1.525,0.6; 10 1.525,1.2 | smd 0.8 x 3: TP -0.175,0 | drill 0.254 pad 0.508: V1 -0.175,1.03; V2 -0.175,0; V3 -0.175,-1.03
1714968-PHONEIX-CONTACT-3-TERMINAL-BLOCK = drill 1.3 pad 5.08: 1 -3.175,0; 2 3.175,0; 3 9.525,0

### Placement (x,y rotation side)
C5  15.25,35 0 top
C6  111.3,33.59 90 top
C7  120,43.5 0 top
C8  81.25,41.31 90 top
C9  87.25,41.31 90 top
C10  75.25,41.31 90 top
C11  122.38,6 0 top
C12  94.12,41.5 90 top
C13  101.5,41 90 top
C14  16.88,43 0 top
C15  25.12,21 180 top
C16  23.5,43 0 top
D1  64.5,62 180 top
D2  59.5,62 180 top
D3  54.5,62 180 top
D4  49.5,62 180 top
D6  44.5,62 180 top
D7  39.5,62 180 top
D8  74.5,62 180 top
D9  71.5,68 180 top
D10  66.5,68 180 top
D11  69.5,62 180 top
D12  56.5,68 180 top
D13  61.5,68 180 top
D14  46.5,68 180 top
D15  51.5,68 180 top
D16  36.5,68 180 top
D17  41.5,68 180 top
D19  24.75,64 0 top
D20  14.75,64 0 top
E1  107.38,36.25 90 top
E2  105.35,36.25 270 top
J1  130,39 180 top
J2  111.5,57 0 top
J4  122,69 270 top
J5  112.5,61.38 90 top
Q1  37.19,39.29 180 top
Q2  43.55,39.29 180 top
Q3  49.88,39.29 180 top
Q4  56.26,39.29 180 top
Q5  62.63,39.29 180 top
Q6  68.95,39.27 180 top
Q8  97.02,52.79 180 top
Q9  93.53,52.79 180 top
Q15  90.03,52.79 180 top
Q17  86.54,52.79 180 top
Q18  83.05,52.79 180 top
Q22  84.25,41.31 180 top
Q23  90.25,41.31 180 top
Q24  78.25,41.31 180 top
R1  120,41.5 180 top
R2  120,39.5 180 top
R3  73.25,49.5 180 top
R4  102,61.6 270 top
R5  102,64.8 270 top
R6  102,68 270 top
R7  102,71.2 270 top
R8  109.28,44.79 0 top
R9  109.28,52.09 0 top
R10  73.25,48 180 top
R11  102.88,53.74 270 top
R12  102.88,50.59 270 top
R13  102.88,47.44 270 top
R14  114.5,56 90 top
R15  73.25,52.5 180 top
R16  24.75,62 0 top
R17  14.62,62.12 0 top
R18  73.25,51 180 top
R19  73.25,55.5 180 top
R20  73.25,54 180 top
TP1  94.5,37 0 top
U1  106.39,32.54 0 top
U2  118.33,48.44 90 top
U4  123,8 180 top
U$1  62.62,26.35 0 top
U$2  49.92,26.35 0 top
U$3  37.23,26.35 0 top
U$4  75.33,26.35 0 top
U$5  107.08,26.35 0 top
U$6  94.38,26.35 0 top
U$8  [PSAS_LOGO_15X15]  25,51.25 0 bottom
U$9  97.5,41 0 top
U$11  17,9 0 top

### Tracks (layer width: path | path; a pad name or v marks a point on that pad's centre or on a via)
3.3V  (via drill 0.25)
  Top 0.152: U$9.7 U$9.6
  Top 0.2: R14.2 114.5,58.86 114.43,58.93
  Top 0.3: U4.8 120.75,7.25 120.5,7.5 120.5,36.5 119.75,37.25 v117,37.25
  Top 0.35: C11.1 121.53,7.22 U4.8
  Top 0.4: U2.5 118.98,44.5 | 118.98,44.5 118.98,43.42 | 118.98,43.42 119.15,43.25 R1.2 R2.2 118.89,39.23 v117,39.23 107.5,39.23 | v118.97,44.5 118.98,44.5 | v119,53.25 119,54.36 114.43,58.93 113.67,59.69 110.92,59.69 109.88,60.73 109.88,65.59 110.75,66.45 J5.3 116.27,66.45 118.8,63.92 J4.3 | C13.1 107.5,39.23 | E1.2 107.38,39.11 107.5,39.23 | C7.1 119.06,43.5 118.98,43.42
  Bottom 0.3: v117,37.25 v117,39.23
  Bottom 0.4: v119,53.25 119,44.53 v118.97,44.5
  pour Top: 98.69,40 102.5,40 102.5,39.88 102.5,38.62 99.06,38.62 98.69,39
12V  (via drill 0.25)
  Top 0.2: U$9.4 U$9.3 U$9.2 | D20.A 12,64 11,63 11,59
  Top 0.3: R15.2 R18.2 R3.2 R10.2 70.5,48 v70.5,46.5
  Top 0.4: Q24.6 77.92,39.92 v78,40 | v78,40 v78,41 | v78,40.5 v78,40 | v84,40.5 v84,41 v84,40 83.92,39.92 Q22.6 | Q23.6 89.92,39.92 v90,40 | v90,40 v90,41 | v90,40.5 v90,40 | C8.1 81.25,40.25 81.5,40
  Top 0.5: C9.1 87.25,40.09 87.34,40 | C10.1 75,40.16 75,40
  Top 1: 87.34,40 v90,40 | v84,40 81.5,40 v78,40 75,40 | 92,40 94.03,40
  Top 1.016: v90,40 92,40 | 94.03,40 C12.1 | v84,40 87.34,40
  other vias: 68.25,46.5 69,46.5 69.75,46.5 70.5,45.75 69.75,45.75 69,45.75 68.25,45.75 68.25,45 69,45 69.75,45 70.5,45 70.5,44.25 69.75,44.25 69,44.25 68.25,44.25 16,5 16,6 16,7 15,6 15,5 14,5 14,6 13,6 13,5 12,6 11,7 10,8 11,8 11,9 10,9 9,9 8,10 9,10 10,10 11,10 11,11 12,12 10,11 9,11 8,11 7,11 6,12 7,12 8,12 9,12 10,12 11,12 13,12 14,12 15,12 16,12 16,11 16,13 15,13 14,13 13,13 12,13 11,13 10,13 9,13 8,13 7,13 6,13 5,13 4,14 3,15 2,16 2,17 2,18 2,19 3,19 4,19 5,19 6,19 7,19 8,19 9,19 10,19 11,19 12,19 13,19 14,19 15,19 16,19 16,18 15,18 14,18 13,18 12,18 11,18 10,18 9,18 8,18 7,18 6,18 5,18 4,18 3,18 3,17 4,17 5,17 6,17 7,17 8,17 9,17 10,17 11,17 12,17 13,17 14,17 15,17 16,17 16,16 15,16 14,16 13,16 12,16 11,16 10,16 9,16 8,16 7,16 6,16 5,16 4,16 3,16 4,15 5,15 6,15 7,15 8,15 9,15 10,15 11,15 12,15 13,15 14,15 15,15 16,15 16,14 15,14 14,14 12,14 11,14 9,14 8,14 7,14 6,14 5,14 10,14 13,14
  pour Top (isolate 0.3): 71.2,41.23 68.02,41.23 67.7,41.55 67.7,42.82 65.17,42.82 65.17,41.55 64.85,41.23 61.67,41.23 61.35,41.55 61.35,42.82 58.81,42.82 58.81,41.55 58.5,41.23 55.32,41.23 55.01,41.55 55.01,42.82 52.47,42.82 52.47,41.55 52.15,41.23 48.97,41.23 48.66,41.55 48.61,41.59 48.61,42.89 46.5,44.87 46.5,47.5 46.5,48 35.51,48 35.64,60.5 71.2,60.5
  pour Bottom: 67.75,46.75 67.75,42.5 72,38.25 91.25,38.25 92,39 92,41.25 91,42.25 76,42.25 71.25,47 68,47
  pour Top: 96.38,41.25 93.56,41.25 93.25,40.94 93.25,40.5 95.25,40.5 95.38,40.62 95.5,40.75 96.38,40.75
  pour Top (isolate 0.3): 16.88,9 16.88,5.38 15.5,4 13,4 1,16 1,58 3,60 3.5,60.5 36.12,60.5 36.12,48 20.5,48 arc90 16.88,44.38
  pour Bottom: 14.38,4 15.5,4 16.88,5.38 16.88,19.5 1,19.5 1,16 3.88,13.12 13,4
+5V  (via drill 0.25)
  Top 0.2: v57.25,61.75 56.5,61 30.38,61 26.38,65 24.25,65 23.87,64.62 D19.A
  Top 0.3: v72.38,56.62 72.4,56.6 R19.2 R20.2
  Bottom 0.2: 57,55.9 57,61.5 v57.25,61.75
  Bottom 0.3: v72.38,56.62 71.65,55.9 66,55.9 57,55.9 54.09,55.9 45.18,47 v45,47
  other vias: 33,13 33,12 33,11 33,10 33,9 33,8 33,7 33,6 33,5 32,5 31,5 30,5 29,5 28,5 27,5 26,5 25,5 24,6 24,7 24,11 24,12 24,13 26,12 28,12 30,12 32,12 32,10 30,10 30,8 32,8 32,6 30,6 28,6 26,6 30,13 28,13 26,13 25,12 27,12 29,12 31,12 31,10 30,11 30,9 31,8 31,6 29,6 27,6 25,6 30,7 25,13 27,13 29,13 31,13 32,13 29,7 29,11 31,7 32,7 32,9 31,9 31,11 32,11 24,47 25,47 26,47 27,47 28,47 29,47 30,47 31,47 32,47 33,47 34,47 35,47 36,47 37,47 38,47 39,47 40,47 41,47 42,47 43,47 44,47 45,46 44,46 43,46 42,46 41,46 40,46 39,46 38,46 37,46 36,46 35,46 34,46 33,46 32,46 31,46 30,46 29,46 28,46 27,46 26,46 25,46 24,46 24,45 26,45 25,45 27,45 28,45 29,45 30,45 31,45 32,45 33,45 34,45 35,45 36,45 37,45 38,45 39,45 40,45 42,45 43,45 44,45 45,45 45,44 44,44 43,44 42,44 41,44 41,45 40,44 39,44 38,44 37,44 36,44 35,44 33,44 34,44 32,44 31,44 30,44 29,44 28,44 27,44 26,44 25,44 24,44
  pour Top (isolate 0.3): 23.5,9 23.5,5.5 25,4 33,4 34,5 34,42.25 34.5,42.75 35.75,42.75 36,42.5 36,41.5 36.25,41.25 39.38,41.25 39.62,41.5 39.62,42.5 39.88,42.75 42,42.75 42.25,42.5 42.25,41.5 42.5,41.25 45.75,41.25 46,41.5 46,47.25 45.62,47.62 24,47.62 23.5,47.12
  pour Bottom: 23.5,9.12 23.5,5.5 25,4 33,4 34,5 34,13.62 23.5,13.62
  pour Bottom: 45.62,47.62 46,47.25 46,43 37.88,43 23.5,43 23.5,47.12 24,47.62
ADC1
  Top 0.3: U1.7 109.99,32.04 113.42,28.61 U$5.3
ADC2
  Top 0.3: U1.6 108.53,27.81 U$5.1
ADC3
  Top 0.3: U1.5 104.24,29.86 U$6.3
ADC4
  Top 0.3: U$6.1 100.06,32.04 U1.4
AGND  (via drill 0.25)
  other vias: 111.5,35.5 118.5,26.5 118.5,18.5 118.5,10.5 118.5,1 110,1 103.5,1 96.5,1 90.5,1 90.5,6 90,11 90,18.5 90,26.5 90,28.5 93,31.5 97,35.5 102,35.5 106,32.5 102,33 112.5,34.5 106,34 103.07,35.48 108,18.5 99.5,18.5 107,9 113.5,9 101,9 94.5,9 102.5,34.41
  pour Top: 119.19,28.81 112,36 97,36 89.75,28.75 89.75,0 119.25,0 119.25,28.75
  pour Bottom: 119.19,28.81 112,36 97,36 89.75,28.75 89.75,0 119.25,0 119.25,28.75
G1
  Top 0.2: Q8.5 97.02,51.2 97.34,50.89 98.58,50.89 101.03,53.34 R11.6
G2
  Top 0.2: Q8.2 97.02,53.43 96.7,53.11 95.75,53.11 95.27,52.63 95.27,51.58 95.27,51.18 95.51,50.94 96.79,50.94 97.19,50.53 98.72,50.53 99.22,51.04 100.73,52.54 R11.8
G3
  Top 0.2: R12.2 100.47,51.79 98.87,50.18 97.05,50.18 96.64,50.59 95.36,50.59 95.01,50.94 93.99,50.94 93.53,51.4 Q9.5 | R12.2
G4
  Top 0.2: Q9.2 93.53,53.43 93.21,53.11 92.26,53.11 91.78,52.63 91.78,51.28 92.12,50.94 93.49,50.94 93.84,50.59 94.87,50.59 95.22,50.24 96.49,50.24 96.9,49.83 99.02,49.83 100.17,50.99 R12.4
G5
  Top 0.2: R12.6 99.88,50.19 99.21,49.52 99.16,49.48 96.75,49.48 96.35,49.88 95.07,49.88 94.72,50.24 93.69,50.24 93.34,50.59 91.98,50.59 91.62,50.94 90.53,50.94 90.03,51.44 Q15.5
G6
  Top 0.2: Q15.2 90.03,53.43 89.72,53.11 88.77,53.11 88.29,52.63 88.29,51.28 88.63,50.94 90.03,50.94 90.38,50.59 91.48,50.59 91.83,50.24 93.2,50.24 93.55,49.88 94.58,49.88 94.93,49.53 96.2,49.53 96.61,49.13 99.31,49.13 99.58,49.39 R12.8
G7
  Top 0.2: R13.6 100.9,47.04 99.87,48.07 96.17,48.07 95.76,48.47 94.49,48.47 94.14,48.83 93.11,48.83 92.76,49.18 91.39,49.18 91.04,49.53 89.95,49.53 89.59,49.88 88.19,49.88 87.84,50.24 85.34,50.24 84.73,50.85 83.41,50.85 83.05,51.21 Q18.5
G8
  Top 0.2: Q18.2 83.05,53.43 82.73,53.11 81.78,53.11 81.5,52.83 81.5,51.62 81.5,51.61 81.5,51.09 81.64,50.94 82.82,50.94 83.27,50.49 84.59,50.49 85.2,49.88 87.69,49.88 88.05,49.53 89.45,49.53 89.8,49.18 90.89,49.18 91.25,48.83 92.61,48.83 92.97,48.47 93.99,48.47 94.34,48.12 95.62,48.12 96.02,47.72 99.72,47.72 101.2,46.24 R13.8
G9
  Top 0.2: R13.2 101.93,48.74 101.9,48.77 96.46,48.77 96.06,49.18 94.78,49.18 94.43,49.53 93.4,49.53 93.05,49.88 91.69,49.88 91.33,50.24 90.24,50.24 89.89,50.59 88.48,50.59 88.13,50.94 87.95,50.94 86.88,50.94 86.54,51.27 Q17.5
G10
  Top 0.2: Q17.2 86.54,53.43 86.22,53.11 85.27,53.11 84.8,52.63 84.8,51.28 85.49,50.59 87.99,50.59 88.34,50.24 89.74,50.24 90.09,49.88 91.19,49.88 91.54,49.53 92.91,49.53 93.26,49.18 94.28,49.18 94.64,48.83 95.91,48.83 96.32,48.42 100.02,48.42 100.6,47.84 R13.4
GND  (via drill 0.25)
  Top 0.4: U2.6 119.63,47
  Top 1: U2.29 119.63,47.14 119.63,47
  other vias: 83.38,52.75 86.88,52.75 90.38,52.75 93.88,52.75 97.38,52.75 119.62,44.56 120.94,44.62 110.62,48.44 111.88,48.44 113.19,48.44 115.5,37.25 104,43 114,41 117,41 92.5,44 76,45 107,40 72.5,62 75,65.25 70,65.5 69.5,67.5 66.5,65.5 64.5,67.5 61.5,65.5 56.5,65.5 51.5,65.5 46.5,65.5 41.5,65.5 53.25,71.25 63.25,70.5 58.25,69.5 48.25,70 67.56,62 94.25,69 89.25,69 84.25,69 79.25,69 75,69 81.94,65.81 80.25,30.25 76.75,30.25 73.5,30.25 73.5,36 35,77 40,77 45,77 50,77 55,77 60,77 65,77 70,77 75,77 80,77 85,77 90,77 95,77 100,77 105,77 110,77 115,77 120,77 125,77 34,1 39,1 44,1 49,1 54,1 59,1 64,1 69,1 74,1 79,1 84,1 88,1 88,6 88,11 88,16 88,21 88,26 88,30 91,32 94,35 110.5,37 112,37 114,36 116,34 118,32 122,23 122,19 124,26 123,32 124,37 124,15.5 122,15.5 124.5,6 123.5,4.5 121,4.5 121,1 125,1 134,9 134,14 134,19 134,24 134,29 134,34 134,39 134,44 134,49 134,54 134,59 134,64 134,69 35,4 35,6 35,8 35,10 35,12 35,14 35,16 37,16 37,14 37,12 37,10 37,8 37,6 37,4 37,2 35,2 37,18 35,18 119,58 119,62 115,65 119,66 116,69 119,70 114,72 122,75 110,75 102,75 95,75 101,58 97,58 93,58 77,58 39,2 39,4 39,6 39,12 39,14 39,16 39,18 39,20 37,20 35,20 42,20 51,20 51,14 44,14 47,17 55,20 64,20 64,14 56,14 60,17 68,20 77,20 77,14 69,14 73,17 80,21 80,16 84,18 85,13 86,5 77,5 72,5 66,5 60,5 54,5 49,5 44,5 38,71 108,72 100.5,55 127,42 127,47 127,53 127,59 127,64 130,66 85,30 87.5,37 85,34 81,37 79.5,35 93,60 84,60 117.25,47.5 97.5,69 119.88,52.38 116.38,54.62 75.5,43.62 127.25,25.25 116,56 112,55.38 113,57.5 91,48 88,48 85,48 82,48 79,48 73,37 73.5,23 56.5,22.5 62.5,22.5 69,22.5 50,22.5 43.5,22.5 37,22.5 97.38,43 96,43 95,44.5 93.5,44.5 92.62,42.5 96.5,38.5 97.38,39 98.25,38.5 98.75,43 99.88,43 102.25,41.62 101.5,41.62 100.75,41.62 103.12,43 106,38.5 104,38.5 103,37.5 101.5,37.5 100,37.5 108.5,38.5 111,40.5 105,41 76.5,37.5 81.5,43.5 81,45 87.5,43.5 87,45 94,38 23,6 17.5,6 18.5,6 19.5,6 22,6 21,6 20.25,6 17.5,7 17.5,8 23,7 23,8 23,9.5 22,12 22,13 21,12 21,13 21,14 22,14 22,15 21,15 21,16 22,16 22,17 21,17 22,18 21,18 21,19 22,19 22,23 21,23 22,24 21,24 21,25 22,25 22,26 21,26 21,27 22,27 22,28 21,28 21,29 22,29 22,30 21,30 22,31 21,31 21,32 22,32 22,33 21,33 21,37 22,37 22,38 21,38 22,39 21,39 21,40 22,40 22,41 21,41 20,12 20,13 20,14 20,15 20,16 20,17 20,18 19,18 18,18 18,17 19,17 19,16 18,16 18,15 19,15 19,14 18,14 18,13 19,13 19,12 18,12 20,19 19,19 18,19 20,23 19,23 18,23 20,24 19,24 18,24 18,25 19,25 20,25 20,26 19,26 18,26 18,27 19,27 20,27 20,28 19,28 18,28 18,29 19,29 20,29 20,30 19,30 18,30 18,31 19,31 20,31 20,32 20,33 19,33 18,33 18,32 19,32 20,37 19,37 18,37 18,38 19,38 20,38 20,39 19,39 18,39 20,40 20,41 19,41 19,40 18,40 18,41 23,5 22,5 21,5 19.5,5 18.5,5 17.5,5 17.5,4 18.5,4 19.5,4 21,4 22,4 23,4 23,3 22,3 21,3 23,2 22,2 21,2 19.5,2 18.5,2 17.5,2 20.25,2 19.5,3 18.5,3 17.5,3 20.25,3 20.25,4 20.25,5 18,11 19,45 21,47 22,46 18,44 20,46 20,44 12.38,61.5 77.62,52.5 76,50.25 75.38,48.75 76.25,54.75 75.88,53.25 73.12,46.5 77.62,56.38 27.62,61.88 45.62,63.5 50.88,63.25 56,63 61.25,62.75 62.62,62 33,63 20,62 30,77 25,77 20,77 15,77 10,77 1,68 1,63 1,59 6,68 11,68 10,72 15,72 20,72 25,72 30,72 35,73 30,68 32,1 34,3 32,3 30,3 30,1 27,1 27,3 25,3 25,1 24,1 24,3 87,11 87,16 87,21 87,26 87,30 87,6 87,1 87.5,13.5 87.5,18.5 87.5,23.5 87.5,28 90,33 93,36 119.75,48.5 124,52 124,45 9.75,61.5
  pour Bottom (rank 2): 135,78 135,0 119.75,0 119.75,29 112.25,36.5 96.75,36.5 89.25,29 89.25,0 87.75,0 0,0 0,78
  pour Top (rank 3): 135,78 135,0 119.75,0 119.75,29 112.25,36.5 96.75,36.5 89.25,29 89.25,0 87.75,0 0,0 0,78
HIGH_OUT_1  (via drill 0.25)
  Top 0.4: Q24.7 78.58,36.83 v78.5,36.75
  Bottom 0.4: v78.5,36.75 78.5,36.25 76.45,34.2 42.98,34.2 40.55,31.77 40.55,15.05 U$3.4
HIGH_OUT_2  (via drill 0.25)
  Top 0.4: Q24.5 77.28,36.75 v77.25,36.75
  Bottom 0.4: v77.25,36.75 77.25,36 76,34.75 42.75,34.75 40,32 40,9.25 U$3.2
HIGH_OUT_3  (via drill 0.25)
  Top 0.4: Q23.7 90.58,36.83 v90.5,36.75
  Bottom 0.4: v90.5,36.75 85.72,31.97 66.75,31.97 65.8,31.02 65.8,15.2 U$1.4
HIGH_OUT_4  (via drill 0.25)
  Top 0.4: Q23.5 89.25,38.31 v89.25,36.75
  Bottom 0.4: v89.25,36.75 85.02,32.52 66.52,32.52 65.25,31.25 65.25,9.4 U$1.2
HIGH_OUT_5  (via drill 0.25)
  Top 0.4: Q22.7 84.58,36.83 v84.5,36.75
  Bottom 0.4: v84.5,36.75 80.82,33.07 55.23,33.07 53.3,31.15 53.3,15 U$2.4
HIGH_OUT_6  (via drill 0.25)
  Top 0.4: Q22.5 83.28,36.77 v83.25,36.75
  Bottom 0.4: v83.25,36.75 80.12,33.62 55,33.62 52.75,31.38 52.75,9.2 U$2.2
LOW_OUT_1
  Top 0.2: Q18.3 81.61,53.89 81.14,53.43 81.14,51.53 73.72,44.11 73.72,38.91 81.67,30.96 U$4.3
LOW_OUT_2
  Top 0.2: Q18.6 84,52.48 84.64,53.11 84.64,54.7 84.32,55.02 81.78,55.02 80.79,54.03 80.79,51.68 73.37,44.25 73.37,41.77 73.37,38.77 78.8,33.34 78.8,14.9 U$4.4
LOW_OUT_3
  Top 0.2: Q17.3 85.59,54.56 84.78,55.37 81.32,55.37 80.44,54.49 80.44,51.82 73.02,44.4 73.02,38.62 78.45,33.19 78.45,8.9 U$4.2
LOW_OUT_4
  Top 0.2: U$4.1 75.33,35.82 72.67,38.48 72.67,44.55 80.09,51.97 80.09,54.64 81.17,55.72 84.71,55.72 84.93,55.72 86,54.64 87.95,54.64 88.09,54.5 88.09,53.15 87.49,52.54 Q17.6
N$1
  Top 0.2: R4.8 100.1,60.4 97.86,62.64 78.14,62.64 76.62,61.12 67.25,61.12 66.38,62 D1.A
N$2
  Top 0.2: R4.6 100.05,61.2 98.26,62.99 62.49,62.99 61.5,62 D2.A
N$3
  Top 0.2: R4.4 100,62 98.66,63.34 57.72,63.34 56.38,62 D3.A
N$4
  Top 0.2: R4.2 99.95,62.8 99.06,63.7 53.2,63.7 51.5,62 D4.A
N$5
  Top 0.35: 107.45,32.54 U1.8 111.1,32.54 C6.1
  Top 0.4: 107.45,32.54 107.25,32.74 107.24,32.75 107.24,33.82 107.38,33.96 E1.1
N$6  (via drill 0.25)
  Top 0.2: U2.14 121.8,51.01 v121.8,51.42 | v118.35,54 117.2,55.15 R14.1 113.35,55.15 J2.1
  Bottom 0.2: v121.8,51.42 119.22,54 v118.35,54
N$7
  Top 0.2: U$9.5 95.97,38.48 TP1.P$1
N$12
  Top 0.2: D19.C 25.6,63.97 R16.2
N$14
  Top 0.2: R5.8 99.9,63.6 99.45,64.05 48.55,64.05 46.5,62 D6.A
N$15
  Top 0.2: R5.6 43.78,64.4 41.38,62 D7.A
N$16  (via drill 0.25)
  Top 0.2: v76.5,62 D8.A | v76.5,65 76.75,64.75 99.55,64.75 100,65.2 R5.4
  Bottom 0.2: v76.5,65 v76.5,62
N$17
  Top 0.2: D9.A 73.5,68 75.05,66.45 99.8,66.45 100.25,66 R5.2
N$18
  Top 0.2: D20.C 15.63,62.28 R17.2
N$26
  Top 0.2: R6.8 75.2,66.8 74.9,67.1 73.25,68.75 69.25,68.75 68.5,68 D10.A
N$27  (via drill 0.25)
  Top 0.2: v70.75,69.75 71.39,69.11 73.39,69.11 74.75,67.75 75.3,67.2 99.83,67.2 100.22,67.6 R6.6 | v71.5,62 D11.A
  Bottom 0.2: v71.5,62 71.5,69 v70.75,69.75
N$28
  Top 0.2: R6.4 100.1,68.4 97.86,70.64 66.39,70.64 62.75,67 60,67 59.5,67 58.5,68 D12.A
N$29
  Top 0.2: R6.2 100.05,69.2 98.26,70.99 66.24,70.99 63.25,68 D13.A
N$38
  Top 0.2: R7.8 100,70 98.66,71.34 57.09,71.34 52.75,67 49.5,67 48.5,68 D14.A
N$39
  Top 0.2: R7.6 99.95,70.8 99.06,71.69 56.95,71.69 53.25,68 D15.A
N$40
  Top 0.2: R7.4 99.9,71.6 99.45,72.05 47.8,72.05 42.75,67 39.5,67 38.5,68 D16.A
N$41
  Top 0.2: D17.A 43.25,68 47.65,72.4 R7.2
OUT1  (via drill 0.25)
  Top 0.2: Q24.4 77.28,45.34 78.04,46.1 83.05,46.1 83.75,46.81 88.75,46.81 89.27,47.32 99.61,47.32 101.34,45.58 104.84,45.58 105.31,46.06 R8.2 108.97,46.06 109.6,45.42 v112.93,45.42 113.57,45.42 114.52,46.38 114.52,46.85 114.81,47.14 U2.27 | R5.5 v104.2,64.4
  Bottom 0.2: v112.93,45.42 112.81,45.55 110.94,45.55 106.59,49.9 106.59,62.01 v104.2,64.4
OUT2  (via drill 0.25)
  Top 0.2: Q24.2 78.58,45.38 78.94,45.75 83.19,45.75 83.9,46.45 88.9,46.45 89.41,46.97 99.46,46.97 99.47,46.97 101.2,45.23 104.98,45.23 105.18,45.42 108.97,45.42 109.6,44.79 R8.8 v112.14,44.79 113.57,44.79 115.27,46.49 U2.28 | R5.7 v104.2,63.6
  Bottom 0.2: v112.14,44.79 111.21,44.79 106.24,49.76 106.24,61.56 v104.2,63.6
OUT3  (via drill 0.25)
  Top 0.2: Q23.4 89.28,45.34 89.85,45.91 99.02,45.91 100.76,44.17 106,44.17 106.65,43.52 R8.4 107.85,43.52 108.5,43.52 108.97,43.52 109.6,42.88 v112.93,42.88 115.63,42.88 117.68,44.93 U2.3 | R4.5 v104.2,61.2
  Bottom 0.2: v112.93,42.88 111.62,42.88 105.18,49.32 105.18,60.22 v104.2,61.2
OUT4  (via drill 0.25)
  Top 0.2: Q23.2 90.58,45.38 90.75,45.56 98.88,45.56 100.61,43.82 105.85,43.82 106.79,42.88 108.97,42.88 109.6,42.25 R8.6 v112.14,42.25 115.63,42.25 118.33,44.95 U2.4 | R4.7 v104.2,60.4
  Bottom 0.2: v112.14,42.25 111.75,42.25 104.83,49.17 104.83,59.77 v104.2,60.4
OUT5  (via drill 0.25)
  Top 0.2: Q22.4 83.28,45.34 84.04,46.1 89.05,46.1 89.56,46.62 99.31,46.62 101.05,44.88 107.77,44.88 107.85,44.79 | U2.1 116.38,44.9 115.63,44.15 v112.93,44.15 109.6,44.15 108.97,44.79 107.85,44.79 | 107.85,44.79 R8.3 | R4.1 v104.2,62.8
  Bottom 0.2: v112.93,44.15 111.34,44.15 105.89,49.61 105.89,61.11 v104.2,62.8
OUT6  (via drill 0.25)
  Top 0.2: Q22.2 84.58,45.38 84.94,45.75 89.19,45.75 89.71,46.27 99.17,46.27 100.91,44.52 106.47,44.52 106.85,44.15 107.5,44.15 108.97,44.15 109.6,43.52 R8.7 v112.14,43.52 115.63,43.52 117.03,44.92 U2.2 | R4.3 v104.2,62
  Bottom 0.2: v112.14,43.52 111.48,43.52 105.54,49.46 105.54,60.66 v104.2,62
OUT7  (via drill 0.25)
  Top 0.2: U2.26 114.82,47.79 114.17,47.13 114.17,46.69 113.53,46.06 v112.14,46.06 R8.9 109.6,46.06 108.97,46.69 105.16,46.69 104.7,46.24 R13.7 | R5.3 v104.2,65.2
  Bottom 0.2: v112.14,46.06 110.93,46.06 106.94,50.05 106.94,62.45 v104.2,65.2
OUT8  (via drill 0.25)
  Top 0.2: U2.25 114.68,48.44 v112.93,46.69 109.6,46.69 108.97,47.33 R8.1 105,47.33 104.68,47.01 103.76,47.01 R13.5 | R5.1 v104.2,66
  Bottom 0.2: v112.93,46.69 110.87,46.69 107.3,50.27 107.3,62.9 v104.2,66
OUT9  (via drill 0.25)
  Top 0.2: U2.24 112.6,49.09 v112.14,49.55 R9.6 109.6,49.55 108.97,50.19 106.74,50.19 104.39,47.84 R13.3 | R6.7 v104.2,66.8
  Bottom 0.2: v112.14,49.55 111.61,49.55 111.33,49.83 107.65,53.51 107.65,63.35 v104.2,66.8
OUT10  (via drill 0.25)
  Top 0.2: U2.23 113.38,49.74 v112.93,50.19 109.6,50.19 108.97,50.82 R9.4 106.58,50.82 104.4,48.64 R13.1 | R6.5 v104.2,67.6
  Bottom 0.2: v112.93,50.19 111.47,50.19 108,53.66 108,63.8 v104.2,67.6
OUT11  (via drill 0.25)
  Top 0.2: U2.20 117.03,51.96 116.9,52.1 116.1,52.1 116.09,52.09 v112.14,52.09 R9.8 109.6,52.09 108.97,52.73 106.11,52.73 104.36,50.98 R12.3 | R7.7 v104.2,70
  Bottom 0.2: v112.14,52.09 111.25,52.09 111.06,52.09 109.07,54.08 109.07,65.13 v104.2,70
OUT12  (via drill 0.25)
  Top 0.2: U2.22 113.62,50.39 113.19,50.82 v112.14,50.82 R9.7 109.6,50.82 108.97,51.46 106.42,51.46 104.36,49.39 R12.7 | R6.3 v104.2,68.4
  Bottom 0.2: v112.14,50.82 111.34,50.82 110.77,51.39 108.37,53.79 108.37,64.23 v104.2,68.4
OUT13  (via drill 0.25)
  Top 0.2: U2.21 113.11,51.28 v112.93,51.46 109.6,51.46 108.97,52.09 R9.3 106.27,52.09 104.36,50.19 R12.5 | R6.1 v104.2,69.2
  Bottom 0.2: v112.93,51.46 111.2,51.46 110.92,51.74 108.72,53.93 108.72,64.68 v104.2,69.2
OUT14  (via drill 0.25)
  Top 0.2: U2.19 117.68,51.95 116.9,52.73 v112.93,52.73 112,52.73 109.6,52.73 108.97,53.36 R9.2 105.95,53.36 104.38,51.79 R12.1 | R7.5 v104.2,70.8
  Bottom 0.2: v104.2,70.8 109.43,65.57 109.43,54.23 110.93,52.73 112,52.73 v112.93,52.73
OUT15  (via drill 0.25)
  Top 0.2: U2.18 118.33,52.09 117.06,53.36 v112.14,53.36 R9.9 109.6,53.36 108.97,54 105.79,54 104.33,52.54 R11.7 | R7.3 v104.2,71.6
  Bottom 0.2: v112.14,53.36 112,53.36 110.79,53.36 110.58,53.58 109.78,54.38 109.78,66.02 v104.2,71.6
OUT16  (via drill 0.25)
  Top 0.2: U2.17 118.98,52.08 118.4,52.65 117.06,54 v112.93,54 109.6,54 108.97,54.63 R9.1 105.63,54.63 104.34,53.34 R11.5 | R7.1 v104.2,72.4
  Bottom 0.2: v112.93,54 112,54 110.66,54 110.13,54.52 110.13,66.47 v104.2,72.4
PWR_FET_G1  (via drill 0.25)
  Top 0.2: Q8.3 96.07,54.62 95.69,55 93.22,55 92.52,55.7 89.95,55.7 89.25,56.41 86.82,56.41 85.74,57.48 80.44,57.48 76.96,54 v75.38,54 R20.1 | v41,42 v41.01,42.01 Q2.G
  Bottom 0.2: v41,42 46.5,42 46.9,42.4 46.9,47.65 51.13,51.87 53.25,54 v75.38,54
PWR_FET_G2  (via drill 0.25)
  Top 0.2: Q8.6 97.97,52.43 98.57,53.03 98.57,54.5 98.42,54.64 96.54,54.64 95.84,55.35 93.37,55.35 92.67,56.05 90.1,56.05 89.39,56.76 86.96,56.76 85.89,57.83 80.3,57.83 77.96,55.5 v75.38,55.5 R19.1 | v34.75,41.25 35.28,41.78 Q1.G
  Bottom 0.2: v34.75,41.25 36.12,42.62 46.55,42.62 46.55,47.79 54.25,55.5 v75.38,55.5
PWR_FET_G3  (via drill 0.25)
  Top 0.2: Q9.3 92.58,54.64 92.22,55 89.66,55 88.95,55.7 86.52,55.7 85.45,56.78 80.73,56.78 79.03,55.08 79.03,52.41 77.62,51 v75.38,51 R18.1 | v53.62,42 v53.63,42.01 Q4.G
  Bottom 0.2: v75.38,51 58.62,51 53.62,46 v53.62,42
PWR_FET_G4  (via drill 0.25)
  Top 0.2: Q9.6 94.48,52.47 95.11,53.11 95.11,54.46 94.93,54.64 93.08,54.64 92.37,55.35 89.8,55.35 89.1,56.05 86.67,56.05 85.59,57.13 80.59,57.13 75.96,52.5 v75.38,52.5 R15.1 | v47.25,42 v47.26,42.01 Q3.G
  Bottom 0.2: v47.25,42 47.25,47.5 51.88,52.12 52.25,52.5 v75.38,52.5
PWR_FET_G5  (via drill 0.25)
  Top 0.2: Q15.3 89.08,54.57 88.66,55 86.23,55 85.16,56.07 84.96,56.07 81.03,56.07 79.73,54.78 79.73,52.11 75.62,48 v75.25,48 R10.1 | v66,42 67.03,42 Q6.G
  Bottom 0.2: v66,42 66,45 66,46 68,48 v75.25,48
PWR_FET_G6  (via drill 0.25)
  Top 0.2: v59.75,42 v59.76,42.01 Q5.G | Q15.6 90.98,52.54 91.59,53.15 91.59,54.5 91.44,54.64 89.51,54.64 88.81,55.35 86.38,55.35 85.3,56.42 80.88,56.42 79.38,54.93 79.38,52.26 76.62,49.5 v75.38,49.5 R3.1
  Bottom 0.2: v59.75,42 59.75,46 63.25,49.5 v75.38,49.5
PWR_P_FET_1
  pour Top (isolate 0.5): 68.97,40.46 66.44,40.46 66.12,40.15 66.12,24.53 67.07,23.58 70.88,23.58 71.83,24.53 71.83,40.15 71.52,40.46
PWR_P_FET_2
  pour Top (isolate 0.5): 62.62,40.46 60.09,40.46 59.77,40.15 59.77,24.53 60.72,23.58 64.53,23.58 65.48,24.53 65.48,40.15 65.17,40.46
PWR_P_FET_3
  pour Top (isolate 0.5): 56.27,40.46 53.73,40.46 53.42,40.15 53.42,24.53 54.37,23.58 58.18,23.58 59.13,24.53 59.13,40.15 58.81,40.46
PWR_P_FET_4
  pour Top (isolate 0.5): 49.92,40.46 47.38,40.46 47.07,40.15 47.07,24.53 48.02,23.58 51.83,23.58 52.78,24.53 52.78,40.15 52.47,40.46
PWR_P_FET_5
  pour Top (isolate 0.5): 43.58,40.46 41.03,40.46 40.72,40.15 40.72,24.53 41.67,23.58 45.48,23.58 46.43,24.53 46.43,40.15 46.12,40.46
PWR_P_FET_6
  pour Top (isolate 0.5): 37.23,40.46 34.69,40.46 34.37,40.15 34.37,24.53 35.32,23.58 39.13,23.58 40.08,24.53 40.08,40.15 39.77,40.46
RX_UART
  Top 0.2: J1.10 125.35,28.41 125.35,59.91 123.88,61.38 J4.4
SCL  (via drill 0.25)
  Top 0.2: 121,38.5 121,39.35 R2.1 120.85,39.84 120.09,40.59 120,40.69 120,42.25 120.25,42.5 v121,42.5 121.5,42.5 122,43 122,46 121.51,46.49 U2.8 | 121,38.5 121.65,37.85 121.65,24.79 123.53,22.91 127.75,18.69 130.01,18.69 | 121,38.5 120.72,38.5 120.71,38.51 120.19,38.51 119.88,38.19 109.19,38.19 108.53,37.53 U1.10 | J1.5 130.01,18.69 | 130.01,18.69 130.01,14.01 125.25,9.25 125.25,8 125,7.75 U4.2 | v123,42.5 122.7,42.8 122.7,51.79 122.09,52.4 113.12,61.38 J5.1
  Bottom 0.2: v123,42.5 v121,42.5
SDA  (via drill 0.25)
  Top 0.2: U2.9 121.86,47.14 122.35,46.65 122.35,46.5 | 121.5,41.5 122,41 122,24.94 123.05,23.89 126.1,20.84 126.21,20.73 126.73,20.73 v126.75,20.75 | 121.5,41.5 R1.1 120.85,40.65 v121,40.5 | 121.5,41.5 122.35,42.35 122.35,46.5 | J1.3 132.85,15.83 132.85,13.85 132.25,13.25 129.75,13.25 125.6,9.1 125.6,7.85 125,7.25 U4.1 | 122.35,46.5 122.35,51.65 113.82,60.18 111.07,60.18 110.37,60.88 110.37,60.92 110.33,60.96 110.33,62.23 112.02,63.91 J5.2 | v120.5,38 120.19,38 120.02,37.84 109.33,37.84 108.88,37.38 108.88,35 110,33.88 110,33.5 109.54,33.04 U1.9
  Bottom 0.2: v121,40.5 121,38.5 v120.5,38 | J1.3 129.99,18.69 127.69,18.69 126.75,19.62 v126.75,20.75
TX_UART
  Top 0.2: J1.8 125,26.22 125,57.72 123.88,58.84 J4.5

### Text on the board
tPlace: HIGH-SIDE-HIGH-POWER-10A-MAX | LOW-SIDE | ADC-IN 3.6V MAX | 5V | 5V | 12V | 12V | 12V | 12V | 500mA MAX | A1 | A0 | A3 | A2 | A5 | A4 | A7 | B0 | I2C | UART | 30A MAX | 1 | 2 | 3 | 4 | 5 | 6 | 1 | 2 | 1 | 2 | 3 | 4 | GND | GND | UPPER | 3.3V | 12V | GND | 5V | B2 | B3 | B4 | B5 | B6 | B7 | A6 | B1 | 1 | 2 | 3 | 4 | 5 | 6 | 3 | 4 | G | G | G | G | SDA | 3.3V | LOWER | SCL | RX | 1.5A MAX | 500mA MAX | TX | HIGH-SIDE-12V | ANALOG GROUND | LOW-SIDE | !RESET-> | I2C ADDRS: / ADC : 0x48 / GPIO : 0x20 / TEMP : 0x18 | TP1
tNames: ORESAT / GROUND STATION / POWER BOARD / OLIVER REW / 2018-08-05